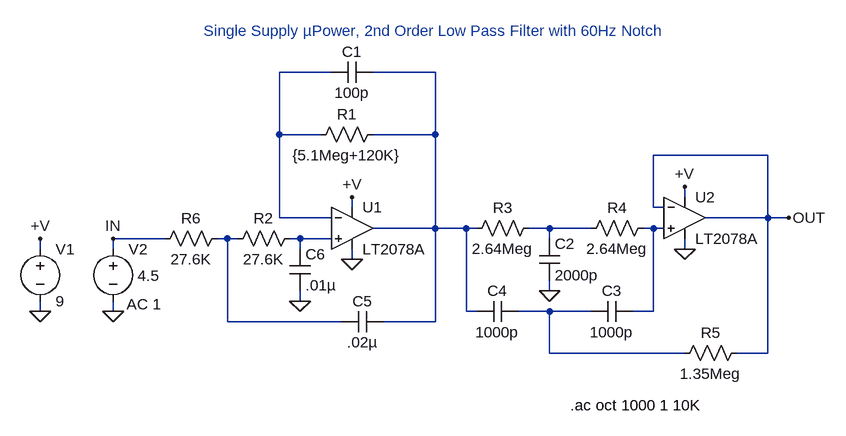
[diagram p0: schematic 2078A.asc]
2078A.asc, the LTspice schematic file:
Version 4
SHEET 1 1220 680
WIRE 144 0 64 0
WIRE 304 0 208 0
WIRE 64 96 64 0
WIRE 128 96 64 96
WIRE 304 96 304 0
WIRE 304 96 208 96
WIRE 816 128 640 128
WIRE 688 192 688 176
WIRE 176 208 176 192
WIRE 640 208 640 128
WIRE 656 208 640 208
WIRE 64 224 64 96
WIRE 144 224 64 224
WIRE 816 224 816 128
WIRE 816 224 720 224
WIRE 848 224 816 224
WIRE 304 240 304 96
WIRE 304 240 208 240
WIRE 352 240 304 240
WIRE 368 240 352 240
WIRE 480 240 448 240
WIRE 544 240 480 240
WIRE 640 240 624 240
WIRE 656 240 640 240
WIRE -112 256 -192 256
WIRE -16 256 -32 256
WIRE 0 256 -16 256
WIRE 96 256 80 256
WIRE 144 256 96 256
WIRE 480 256 480 240
WIRE -304 272 -304 256
WIRE -192 272 -192 256
WIRE 96 272 96 256
WIRE 688 272 688 256
WIRE 176 288 176 272
WIRE 480 336 480 320
WIRE 96 352 96 336
WIRE -304 368 -304 352
WIRE -192 368 -192 352
WIRE 352 368 352 240
WIRE 368 368 352 368
WIRE 480 368 432 368
WIRE 544 368 480 368
WIRE 640 368 640 240
WIRE 640 368 608 368
WIRE -16 384 -16 256
WIRE 160 384 -16 384
WIRE 304 384 304 240
WIRE 304 384 224 384
WIRE 480 432 480 368
WIRE 688 432 480 432
WIRE 816 432 816 224
WIRE 816 432 768 432
FLAG -304 368 0
FLAG 176 192 +V
FLAG -304 256 +V
FLAG 688 176 +V
FLAG 96 352 0
FLAG -192 368 0
FLAG 848 224 OUT
FLAG -192 256 IN
FLAG 176 288 0
FLAG 688 272 0
FLAG 480 336 0
SYMBOL voltage -304 256 R0
SYMATTR InstName V1
SYMATTR Value 9
SYMBOL res 224 80 R90
WINDOW 0 0 56 VBottom 0
WINDOW 3 32 56 VTop 0
SYMATTR InstName R1
SYMATTR Value {5.1Meg+120K}
SYMBOL cap 208 -16 R90
WINDOW 0 0 32 VBottom 0
WINDOW 3 32 32 VTop 0
SYMATTR InstName C1
SYMATTR Value 100p
SYMBOL res 464 224 R90
WINDOW 0 0 56 VBottom 0
WINDOW 3 32 56 VTop 0
SYMATTR InstName R3
SYMATTR Value 2.64Meg
SYMBOL res 640 224 R90
WINDOW 0 0 56 VBottom 0
WINDOW 3 32 56 VTop 0
SYMATTR InstName R4
SYMATTR Value 2.64Meg
SYMBOL cap 464 256 R0
SYMATTR InstName C2
SYMATTR Value 2000p
SYMBOL res 784 416 R90
WINDOW 0 0 56 VBottom 0
WINDOW 3 32 56 VTop 0
SYMATTR InstName R5
SYMATTR Value 1.35Meg
SYMBOL cap 608 352 R90
WINDOW 0 0 32 VBottom 0
WINDOW 3 32 32 VTop 0
SYMATTR InstName C3
SYMATTR Value 1000p
SYMBOL cap 432 352 R90
WINDOW 0 0 32 VBottom 0
WINDOW 3 32 32 VTop 0
SYMATTR InstName C4
SYMATTR Value 1000p
SYMBOL res 96 240 R90
WINDOW 0 0 56 VBottom 0
WINDOW 3 32 56 VTop 0
SYMATTR InstName R2
SYMATTR Value 27.6K
SYMBOL res -16 240 R90
WINDOW 0 0 56 VBottom 0
WINDOW 3 32 56 VTop 0
SYMATTR InstName R6
SYMATTR Value 27.6K
SYMBOL cap 224 368 R90
WINDOW 0 0 32 VBottom 0
WINDOW 3 32 32 VTop 0
SYMATTR InstName C5
SYMATTR Value .02µ
SYMBOL cap 80 272 R0
SYMATTR InstName C6
SYMATTR Value .01µ
SYMBOL voltage -192 256 R0
WINDOW 3 38 57 Left 0
WINDOW 123 21 101 Left 0
SYMATTR Value 4.5
SYMATTR Value2 AC 1
SYMATTR InstName V2
SYMBOL opamps\\LT2078A 176 176 R0
SYMATTR InstName U1
SYMBOL opamps\\LT2078A 688 160 R0
SYMATTR InstName U2
TEXT 512 512 Left 0 !.ac oct 1000 1 10K
TEXT 304 -48 Bottom 0 ;Single Supply µPower, 2nd Order Low Pass Filter with 60Hz Notch

The netlist it stands for:
* 2078A.asc
V1 +V 0 9
R1 N002 N001 {5.1Meg+120K}
C1 N002 N001 100p
R3 N003 N002 2.64Meg
R4 N004 N003 2.64Meg
C2 N003 0 2000p
R5 OUT N007 1.35Meg
C3 N004 N007 1000p
C4 N007 N002 1000p
R2 N006 N005 27.6K
R6 N005 IN 27.6K
C5 N002 N005 .02µ
C6 N006 0 .01µ
V2 IN 0 4.5 AC 1
XU1 N006 N001 +V 0 N002 LT2078A  ; pins In+ In- V+ V- OUT
XU2 N004 OUT +V 0 OUT LT2078A  ; pins In+ In- V+ V- OUT
.ac oct 1000 1 10K
* Single Supply µPower, 2nd Order Low Pass Filter with 60Hz Notch
.backanno
.end